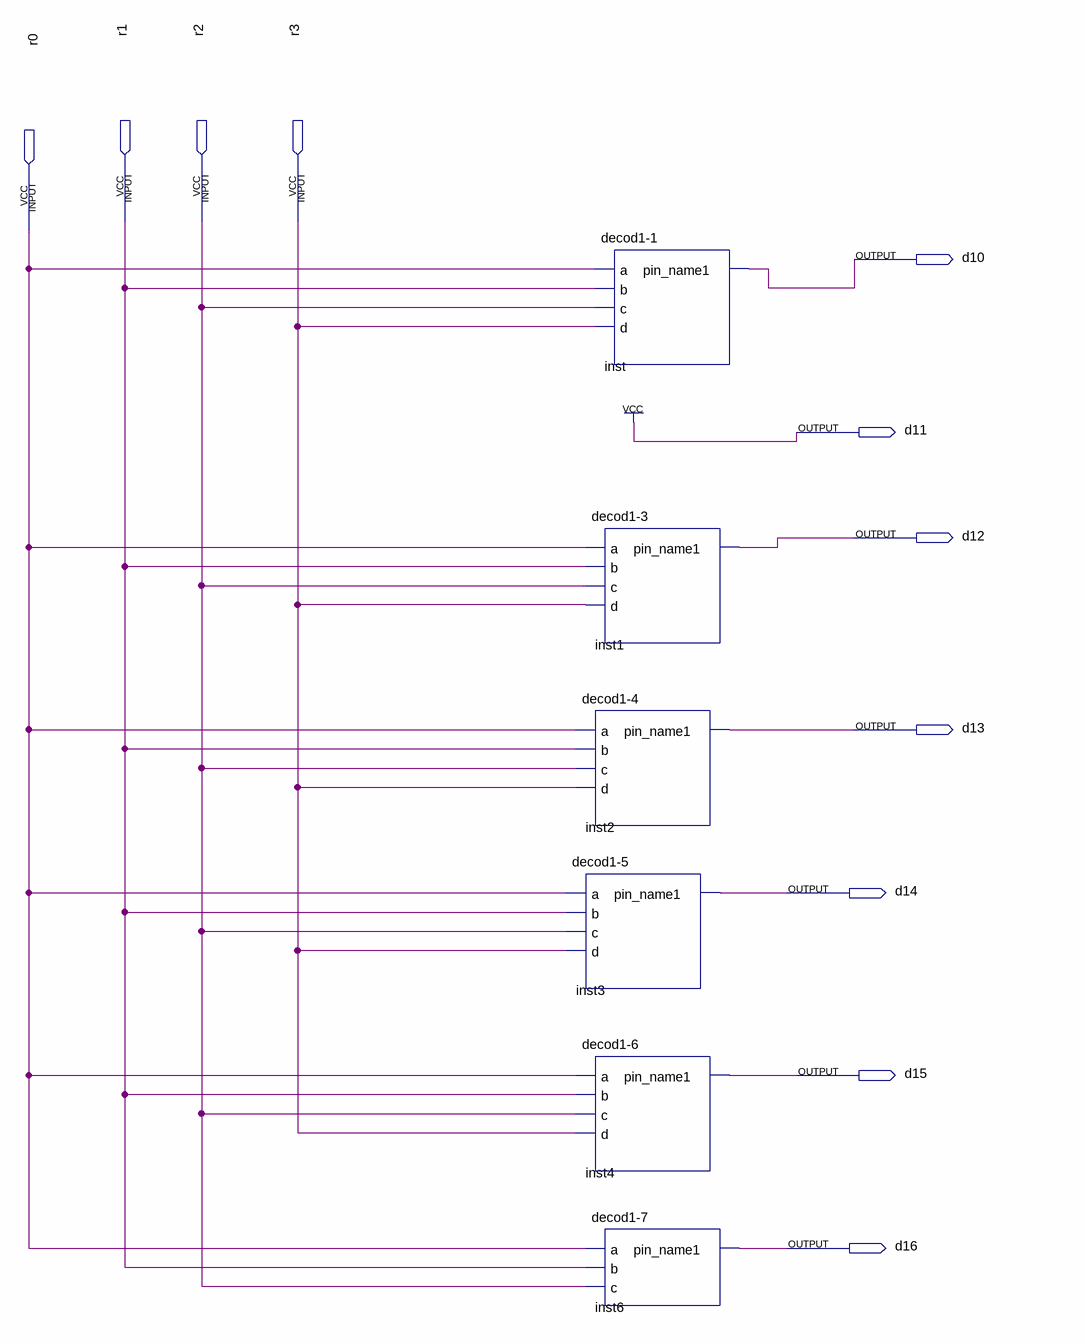
[diagram p0: schematic sheet]
// Quartus schematic decodCompleto-2.bdf as structural Verilog: 6 symbols, 11 pins
module \decodCompleto-2  (
  input  r1,
  input  r2,
  input  r3,
  input  r0,
  output d10,
  output d11,
  output d12,
  output d13,
  output d14,
  output d15,
  output d16
);

  \decod1-1  inst (.a(r0), .b(r1), .c(r2), .d(r3), .pin_name1(d10));
  \decod1-3  inst1 (.a(r0), .b(r1), .c(r2), .d(r3), .pin_name1(d12));
  \decod1-4  inst2 (.a(r0), .b(r1), .c(r2), .d(r3), .pin_name1(d13));
  \decod1-5  inst3 (.a(r0), .b(r1), .c(r2), .d(r3), .pin_name1(d14));
  \decod1-6  inst4 (.a(r0), .b(r1), .c(r2), .d(r3), .pin_name1(d15));
  \decod1-7  inst6 (.a(r0), .b(r1), .c(r2), .pin_name1(d16));

  assign d11 = 1'b1;
endmodule
